# EAGLE schematic Schematic (EAGLE 6.4)
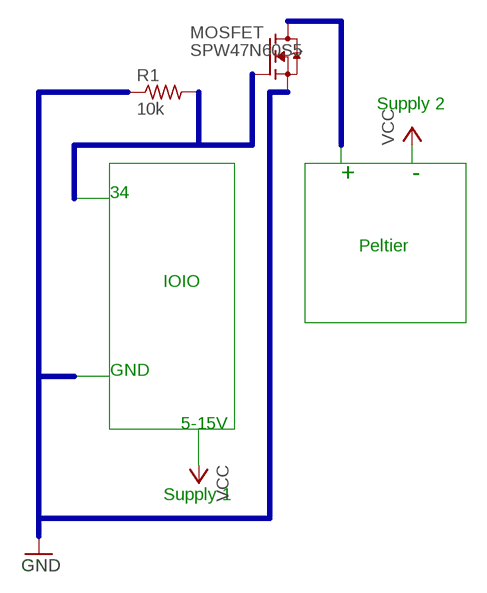
[diagram p0: schematic, sheet 1]

## Parts
MOSFET  SPW47N60S5  [P-TO247]
R1  10k  R-US_0204/2V  [0204V]
Unconnected: MOSFET.1(G) MOSFET.2(D) MOSFET.3(S) R1.1 R1.2

## Buses
B$1
B$2
B$3
B$4

## Notes on the sheet
- Supply 2
- + | -
- 34
- Peltier
- IOIO
- GND
- 5-15V
- Supply 1
- GND

## Library data of the parts
MOSFET = transistor-fet:SPW47N60S5: Cool MOS Power Transistor
R1 = resistor:R-US_: RESISTOR, American symbol